# Altium schematic sheet Leds.SchDoc
size A
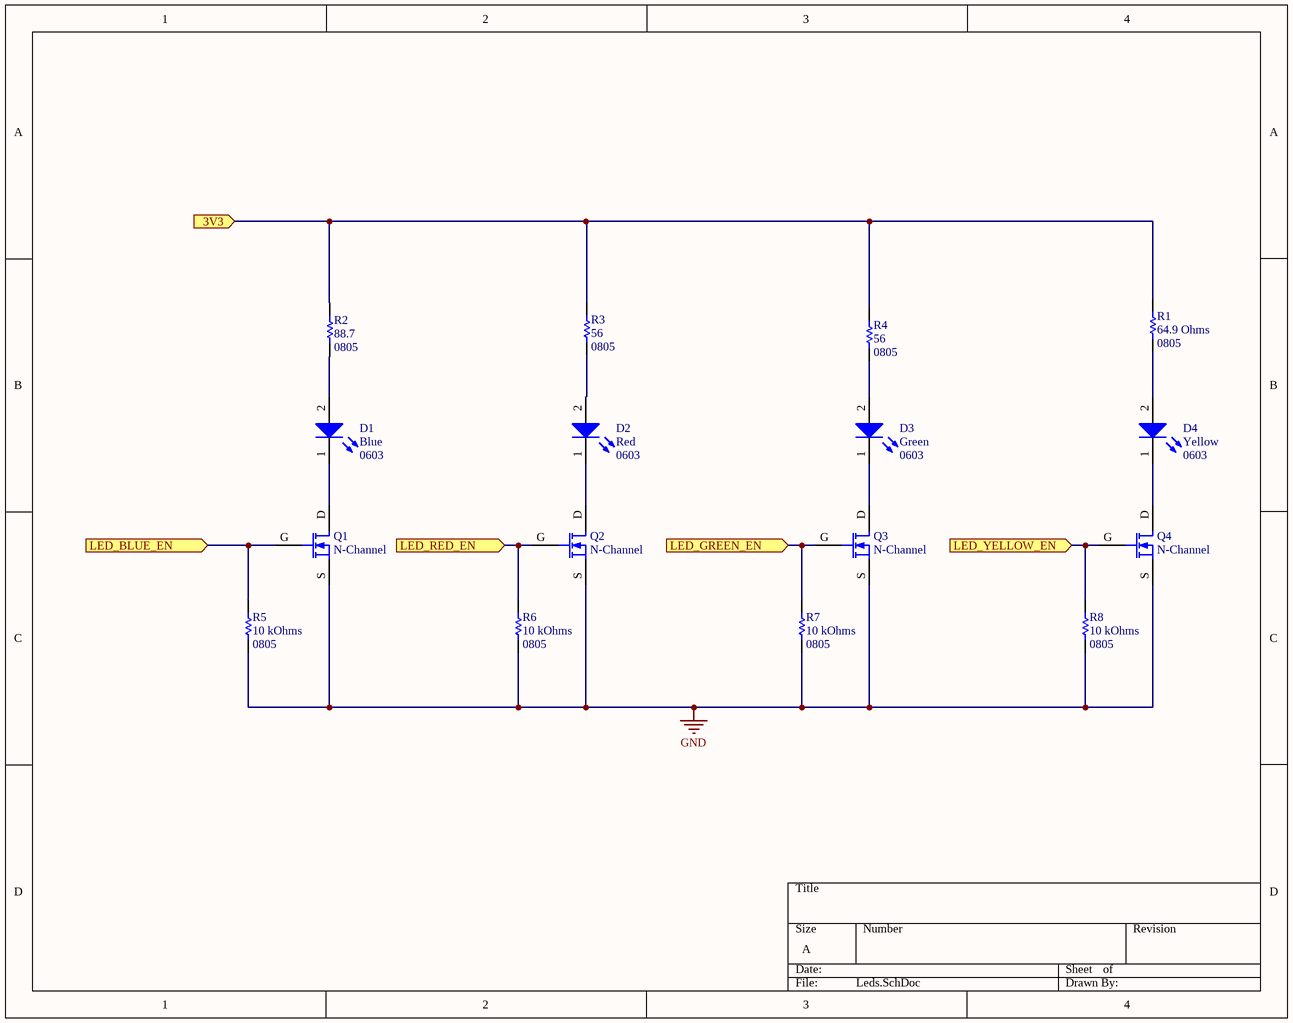
[diagram p0: Leds.SchDoc]

## Parts
D1  Color: Blue  Package / Case: 0603  [SMLE12BC7TT86]  (hidden comment: SMLE12BC7TT86)
D2  Color: Red  Package / Case: 0603  [SML-D12U8WT86]  (hidden comment: SML-D12U8WT86)
D3  Color: Green  Package / Case: 0603  [SML-D12M8WT86]  (hidden comment: SML-D12M8WT86)
D4  Colour: Yellow  Package / Case: 0603  [SML-511WWT86]  (hidden comment: SML-511WWT86)
Q1  FET Type: N-Channel  [2N7002P,215]  (hidden comment: 2N7002P,215)
Q2  FET Type: N-Channel  [2N7002P,215]  (hidden comment: 2N7002P,215)
Q3  FET Type: N-Channel  [2N7002P,215]  (hidden comment: 2N7002P,215)
Q4  FET Type: N-Channel  [2N7002P,215]  (hidden comment: 2N7002P,215)
R1  Resistance: 64.9 Ohms  Package / Case: 0805  [RES0805]  (hidden comment: ERJ-6ENF64R9V)
R2  Resistance: 88.7  Package / Case: 0805  [RES0805]  (hidden comment: CRCW080588R7FKEA)
R3  Resistance (Ohms): 56  Package / Case: 0805  [RES0805]  (hidden comment: RMCF0805JT56R0)
R4  Resistance (Ohms): 56  Package / Case: 0805  [RES0805]  (hidden comment: RMCF0805JT56R0)
R5  Resistance: 10 kOhms  Package / Case: 0805  [RES0805]  (hidden comment: RC0805FR-0710KL)
R6  Resistance: 10 kOhms  Package / Case: 0805  [RES0805]  (hidden comment: RMCF0805FT10K0)
R7  Resistance: 10 kOhms  Package / Case: 0805  [RES0805]  (hidden comment: RMCF0805FT10K0)
R8  Resistance: 10 kOhms  Package / Case: 0805  [RES0805]  (hidden comment: RMCF0805FT10K0)

## Ports
3V3 (in), LED_BLUE_EN (in), LED_GREEN_EN (in), LED_RED_EN (in), LED_YELLOW_EN (in)

## Nets
GND: Q1.S Q2.S Q3.S Q4.S R5.1 R6.1 R7.1 R8.1
3V3: R1.2 R2.2 R3.2 R4.2 ; port 3V3
LED_BLUE_EN: Q1.G R5.2 ; port LED_BLUE_EN
LED_GREEN_EN: Q3.G R7.2 ; port LED_GREEN_EN
LED_RED_EN: Q2.G R6.2 ; port LED_RED_EN
LED_YELLOW_EN: Q4.G R8.2 ; port LED_YELLOW_EN
NetD1_1: D1.1(K) Q1.D
NetD1_2: D1.2(A) R2.1
NetD2_1: D2.1(K) Q2.D
NetD2_2: D2.2(A) R3.1
NetD3_1: D3.1(K) Q3.D
NetD3_2: D3.2(A) R4.1
NetD4_1: D4.1(K) Q4.D
NetD4_2: D4.2(A) R1.1

## Library data of the parts
D1 = SMLE12BC7TT86: LED BLUE CLEAR 0603 SMD; Lens Color: Colorless; Millicandela Rating: 22mcd; Lens Style/Size: Rectangle with Flat Top, 1.20mm x 0.80mm; Voltage - Forward (Vf) (Typ): 2.9V; Current - Test: 5mA; Wavelength - Dominant: 470nm; Lens Transparency: Clear; Supplier 1: Digi-Key; Supplier Part Number 1: 511-1589-1-ND
D2 = SML-D12U8WT86: LED RED DIFFUSED 0603 SMD; Lens Color: White; Millicandela Rating: 63mcd; Voltage - Forward (Vf) (Typ): 2.2V; Current - Test: 20mA; Wavelength - Dominant: 620nm; Supplier 1: Digi-Key; Supplier Part Number 1: 511-1580-1-ND; Lens Transparency: Diffused
D3 = SML-D12M8WT86: LED GREEN DIFFUSED 0603 SMD; Lens Color: White; Millicandela Rating: 25mcd; Lens Style/Size: Rectangle with Flat Top, 1.20mm x 0.80mm; Voltage - Forward (Vf) (Typ): 2.2V; Current - Test: 20mA; Wavelength - Dominant: 572nm; Lens Transparency: Diffused; Supplier 1: Digi-Key; Supplier Part Number 1: 511-1578-1-ND
D4 = SML-511WWT86: LED YELLOW DIFFUSED 0603 SMD; Detailed Description: Yellow 590nm LED Indication - Discrete 2V 0603 (1608 Metric); Lens Colour: White; Millicandela Rating: 40mcd; Lens Style/Size: Rectangle with Flat Top, 1.20mm x 0.80mm; Voltage - Forward (Vf) (Type): 2V; Current - Test: 20mA; Wavelength - Dominant: 590nm; Lens Transparancy: Diffused; Mounting Type: Surface Mount; Height - Max: 0.65mm; Supplier 1: Digi-Key
Q1-Q4 = 2N7002P,215: MOSFET N-CH 60V 0.36A SOT-23; Current - Continuous Drain (Id) @ 25°C: 360mA (Ta); Drive Voltage (Max Rds On, Min Rds On): 10V; Vgs(th) (Max) @ Id  2.4V @: 250µA; Gate Charge (Qg) (Max) @ Vgs: 0.8nC @ 4.5V; Input Capacitance (Ciss) (Max) @ Vds: 50pF @ 10V; Vgs (Max): ±20V; Power Dissipation (Max): 350mW (Ta); Rds On (Max) @ Id, Vgs: 1.6 Ohm @ 500mA, 10V; Technology: MOSFET (Metal Oxide); Drain to Source Voltage (Vdss): 60V; Package / Case: TO-236-3, SC-59, SOT-23-3; Supplier 1: Digi-Key; Supplier Part Number 1: 1727-4692-1-ND
R1 = ERJ-6ENF64R9V: RES SMD 64.9 OHM 1% 1/8W 0805; Power (Watts): 0.125W, 1/8W; Detailed Description: ±1% 0.125W, 1/8W Chip Resistor 0805 (2012 Metric) Automotive AEC-Q200 Thick Film; Supplier 1: Digi-Key; Supplier Part Number 1: P64.9CCT-ND; Tolerance: ±1%; Features: Automotive AEC-Q200; Operating Temperature: -55°C ~ 155°C; Height - Seated (Max): 0.028" (0.70mm)
R2 = CRCW080588R7FKEA: RES SMD 88.7 OHM 1% 1/8W 0805; Power (Watts): 0.125W, 1/8W; Supplier 1: Digi-Key; Supplier Part Number 1: 541-88.7CCT-ND; Tolerance: ±1%; Operating Temperature: -55°C ~ 155°C
R3 R4 = RMCF0805JT56R0: RES SMD 56 OHM 5% 1/8W 0805; Power (Watts): 0.125W, 1/8W; Supplier 1: Digi-Key; Supplier Part Number 1: RMCF0805JT56R0CT-ND; Composition: Thick Film
R5 = RC0805FR-0710KL: RES SMD 10K OHM 1% 1/8W 0805; Manufacturer: Yageo; Power (Watts): 0.125W, 1/8W; Temperature Coefficient: ±100ppm/°C; Supplier 1: Digi-Key; Supplier Part Number 1: 311-10.0KCRCT-ND; Tolerance: ±1%; Composition: Thick Film; Features: Moisture Resistant; Operating Temperature: -55°C ~ 155°C
R6-R8 = RMCF0805FT10K0: RES SMD 10K OHM 1% 1/8W 0805; Power (Watts): 0.125W, 1/8W; Supplier 1: Digi-Key; Tolerance: ±1%; Features: Automotive AEC-Q200; Height - Seated (Max): 0.026" (0.65mm); Supplier Part Number 1: RMCF0805FT10K0CT-ND